# Altium schematic sheet Display.SchDoc
size A4; SheetNumber: 14; SheetTotal: 16
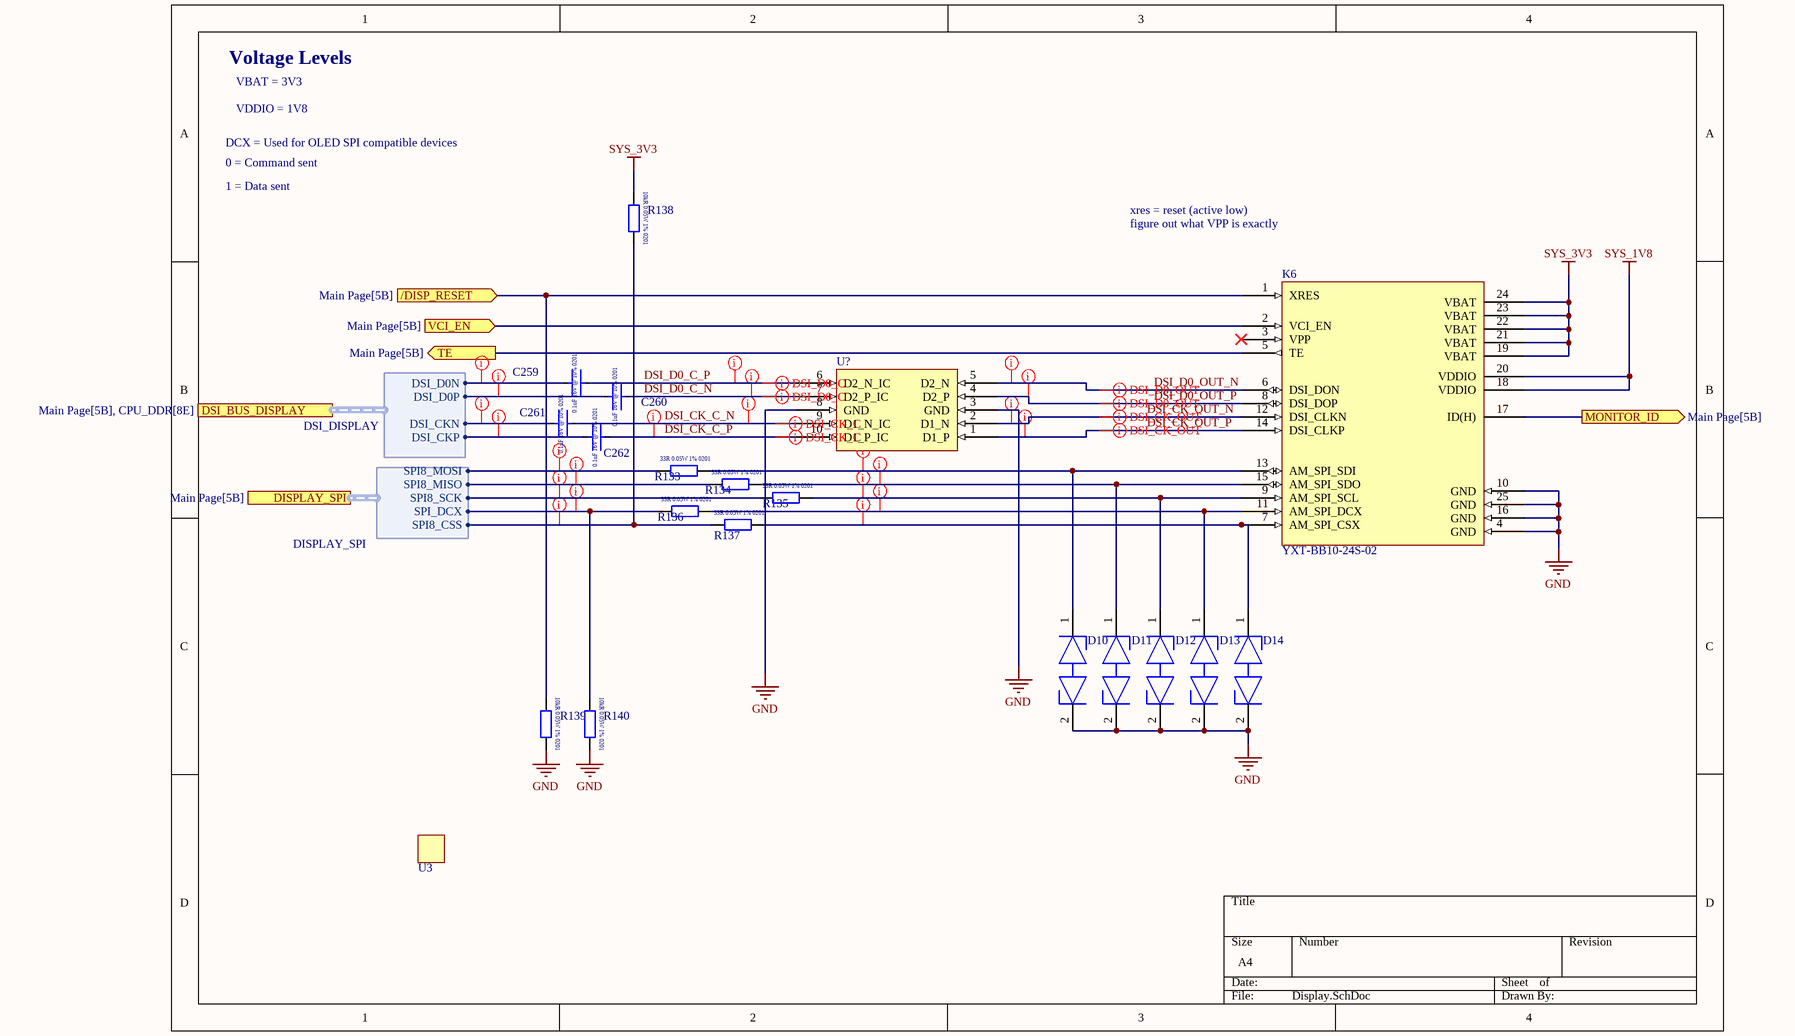
[diagram p0: Display.SchDoc]

## Parts
C259  0.1uF  [CAPC0603X03L]  (value not drawn)
C260  0.1uF  [CAPC0603X03L]  (value not drawn)
C261  0.1uF  [CAPC0603X03L]  (value not drawn)
C262  0.1uF  [CAPC0603X03L]  (value not drawn)
D10  PESD5V0H1BSFYL  [FP-SOD962-2-MFG]  (value not drawn)
D11  PESD5V0H1BSFYL  [FP-SOD962-2-MFG]  (value not drawn)
D12  PESD5V0H1BSFYL  [FP-SOD962-2-MFG]  (value not drawn)
D13  PESD5V0H1BSFYL  [FP-SOD962-2-MFG]  (value not drawn)
D14  PESD5V0H1BSFYL  [FP-SOD962-2-MFG]  (value not drawn)
K6  YXT-BB10-24S-02  [YXT_BB10_24S_02]
R133  ERJ-1GNF33R0C  [RESC0603X03L]  (value not drawn)
R134  ERJ-1GNF33R0C  [RESC0603X03L]  (value not drawn)
R135  ERJ-1GNF33R0C  [RESC0603X03L]  (value not drawn)
R136  ERJ-1GNF33R0C  [RESC0603X03L]  (value not drawn)
R137  ERJ-1GNF33R0C  [RESC0603X03L]  (value not drawn)
R138  ERJ-1GNF1002C  [RESC0603X03L]  (value not drawn)
R139  ERJ-1GNF1002C  [RESC0603X03L]  (value not drawn)
R140  ERJ-1GNF1002C  [RESC0603X03L]  (value not drawn)
U3  UCM-iMX95  [UCM-iMX95]  (value not drawn)
U?  ECMF4-40A100N10  [ECMF4-40A100N10]  (value not drawn)

## Ports
/DISP_RESET (in, see Main Page[5B]), DISPLAY_SPI (harness DISPLAY_SPI, see Main Page[5B]), DSI_BUS_DISPLAY (harness DSI_DISPLAY, see Main Page[5B], CPU_DDR[8E]), MONITOR_ID (out, see Main Page[5B]), TE (out, see Main Page[5B]), VCI_EN (in, see Main Page[5B])

## Harnesses
DSI_DISPLAY: DSI_CKN, DSI_CKP, DSI_D0N, DSI_D0P
DISPLAY_SPI: SPI8_CSS, SPI8_MISO, SPI8_MOSI, SPI8_SCK, SPI_DCX

## Nets
GND: D10.2(K2) D11.2(K2) D12.2(K2) D13.2(K2) D14.2(K2) K6.4(GND) K6.10(GND) K6.16(GND) K6.25(GND) R139.2 R140.2 U?.3(GND) U?.8(GND)
SYS_1V8: K6.18(VDDIO) K6.20(VDDIO)
SYS_3V3: K6.19(VBAT) K6.21(VBAT) K6.22(VBAT) K6.23(VBAT) K6.24(VBAT) R138.1
/DISP_RESET: K6.1(XRES) R139.1 ; port /DISP_RESET
DSI_CK_C_N: C261.1 U?.9(D1_N_IC)
DSI_CK_C_P: C262.1 U?.10(D1_P_IC)
DSI_CK_OUT_N: K6.12(DSI_CLKN) U?.2(D1_N)
DSI_CK_OUT_P: K6.14(DSI_CLKP) U?.1(D1_P)
DSI_D0_C_N: C260.1 U?.7(D2_P_IC)
DSI_D0_C_P: C259.1 U?.6(D2_N_IC)
DSI_D0_OUT_N: K6.6(DSI_DON) U?.5(D2_N)
DSI_D0_OUT_P: K6.8(DSI_DOP) U?.4(D2_P)
MONITOR_ID: K6.17(ID(H)) ; port MONITOR_ID
TE: K6.5(TE) ; port TE
VCI_EN: K6.2(VCI_EN) ; port VCI_EN
NetC259_2: C259.2 ; port DSI_BUS_DISPLAY.DSI_D0N
NetC260_2: C260.2 ; port DSI_BUS_DISPLAY.DSI_D0P
NetC261_2: C261.2 ; port DSI_BUS_DISPLAY.DSI_CKN
NetC262_2: C262.2 ; port DSI_BUS_DISPLAY.DSI_CKP
NetD10_1: D10.1(K1) K6.13(AM_SPI_SDI) R133.2
NetD11_1: D11.1(K1) K6.15(AM_SPI_SDO) R134.2
NetD12_1: D12.1(K1) K6.9(AM_SPI_SCL) R135.2
NetD13_1: D13.1(K1) K6.11(AM_SPI_DCX) R136.2
NetD14_1: D14.1(K1) K6.7(AM_SPI_CSX) R137.2
NetR133_1: R133.1 ; port DISPLAY_SPI.SPI8_MOSI
NetR134_1: R134.1 ; port DISPLAY_SPI.SPI8_MISO
NetR135_1: R135.1 ; port DISPLAY_SPI.SPI8_SCK
NetR136_1: R136.1 R140.1 ; port DISPLAY_SPI.SPI_DCX
NetR137_1: R137.1 R138.2 ; port DISPLAY_SPI.SPI8_CSS

Not connected (* = marked no-connect by the designer): K6 3(VPP)*

## Layout directives
net class DISPLAY_SPI: NetD10_1, NetD11_1, NetD12_1, NetD13_1, NetD14_1, NetR133_1, NetR134_1, NetR135_1, NetR136_1, NetR137_1
net class MIPI DSI to display: DSI_CK_C_N, DSI_CK_C_P, DSI_CK_OUT_N, DSI_CK_OUT_P, DSI_D0_C_N, DSI_D0_C_P, DSI_D0_OUT_N, DSI_D0_OUT_P, NetC259_2, NetC260_2, NetC261_2, NetC262_2
differential pair: DSI_CK_C_N, DSI_CK_C_P, DSI_CK_OUT_N, DSI_CK_OUT_P, DSI_D0_C_N, DSI_D0_C_P, DSI_D0_OUT_N, DSI_D0_OUT_P

## Notes on the sheet
- Voltage Levels
- VBAT = 3V3
- VDDIO = 1V8
- DCX = Used for OLED SPI compatible devices
- 0 = Command sent
- 1 = Data sent
- xres = reset (active low)
- figure out what VPP is exactly
- (in symbol ERJ-1GNF33R0C) 33R 0.05W 1% 0201
- (in symbol ERJ-1GNF1002C) 10kR 0.05W 1% 0201
- (in symbol GRM033R61E104KE14J) 0.1uF 16V @ 10% 0201

## Library data of the parts
C259-C262 = GRM033R61E104KE14J: 0.1 µF ±10% 25V Ceramic Capacitor X5R 0201 (0603 Metric)0.1 µF ±10% 25V Ceramic Capacitor X5R 0201 (0603 Metric); ComponentLink1Description: New link; ComponentLink1URL: https://www.digikey.com.au/en/products/detail/murata-electronics/GRM033R61E104KE14J/4904732?s=N4IgTCBcDaIOICUCyAGAzGhA2AjAURxQBYBpAogKRAF0BfIA
D10-D14 = CMP-14436-000004-1: TVS DIODE 5V 5V DSN0603-2; Manufacturer: Nexperia; Breakdown Voltage: 6V; Direction: Bidirectional; Value: 0.15pF; Clamping Voltage: 6.3V; Number Of Channels: 1; Peak Pulse Current: 7A; Max Junction Temp: +150°C; Lead Free: Yes; Reverse Standoff Voltage: 5V; Footprint Url: https://assets.nexperia.com/documents/outline-drawing/SOD962-2.pdf; ComponentLink2Description: Datasheet; Height: 0.32mm; Ambient Temperature Range Low: -40°C; Manufacturer Part Number: PESD5V0H1BSFYL; Octopart: https://octopart.com/pesd5v0h1bsfyl-nexperia-78741149; Ambient Temperature Range High: +125°C; RoHS: TRUE; Temperature: to +150°C; Capacitance: 0.15pF; ComponentLink2URL: https://assets.nexperia.com/documents/data-sheet/PESD5V0H1BSF.pdf; Temperature Range High: +150°C; Device Class L2: TVS Diodes; Digikey Description: TVS DIODE 5V 5V DSN0603-2; Category: Diode; Device Class L3: unset; Device Class L1: Circuit Protection; Package: SOD962-2; Automotive: No
K6 = YXT-BB10-24S-02: P=0.4mm Wire To Board / Wire To Wire Connector RoHS -> 24 pin
R133-R137 = ERJ-1GNF33R0C: 33 Ohms ±1% 0.05W, 1/20W Chip Resistor 0201 (0603 Metric) Thick Film; ComponentLink1Description: New link; ComponentLink1URL: https://www.digikey.com.au/en/products/detail/panasonic-electronic-components/ERJ-1GNF33R0C/2035941
R138-R140 = ERJ-1GNF1002C: 10 kOhms ±1% 0.05W, 1/20W Chip Resistor 0201 (0603 Metric) Thick Film; ComponentLink1Description: New link; ComponentLink1URL: https://www.digikey.com.au/en/products/detail/panasonic-electronic-components/ERJ-1GNF1002C/2036226
U3 = UCM-iMX95: ARM Cortex-A55 6x CPU cores, 2.0GHz / Up to 16GB LPDDR5 and 128GB eMMC / ARM Mali GPU, 4K VPU and AI/ML NPU / Real-time ARM Cortex-M7 MCU / Tiny size and weight - 28 x 40 mm, 10 gram
U? = ECMF4-40A100N10: 4 Line Common Mode Choke Surface Mount 100mA DCR 3Ohm (Typ); ComponentLink1Description: New link; ComponentLink1URL: https://www.digikey.com/en/products/detail/stmicroelectronics/ECMF4-40A100N10/16379603